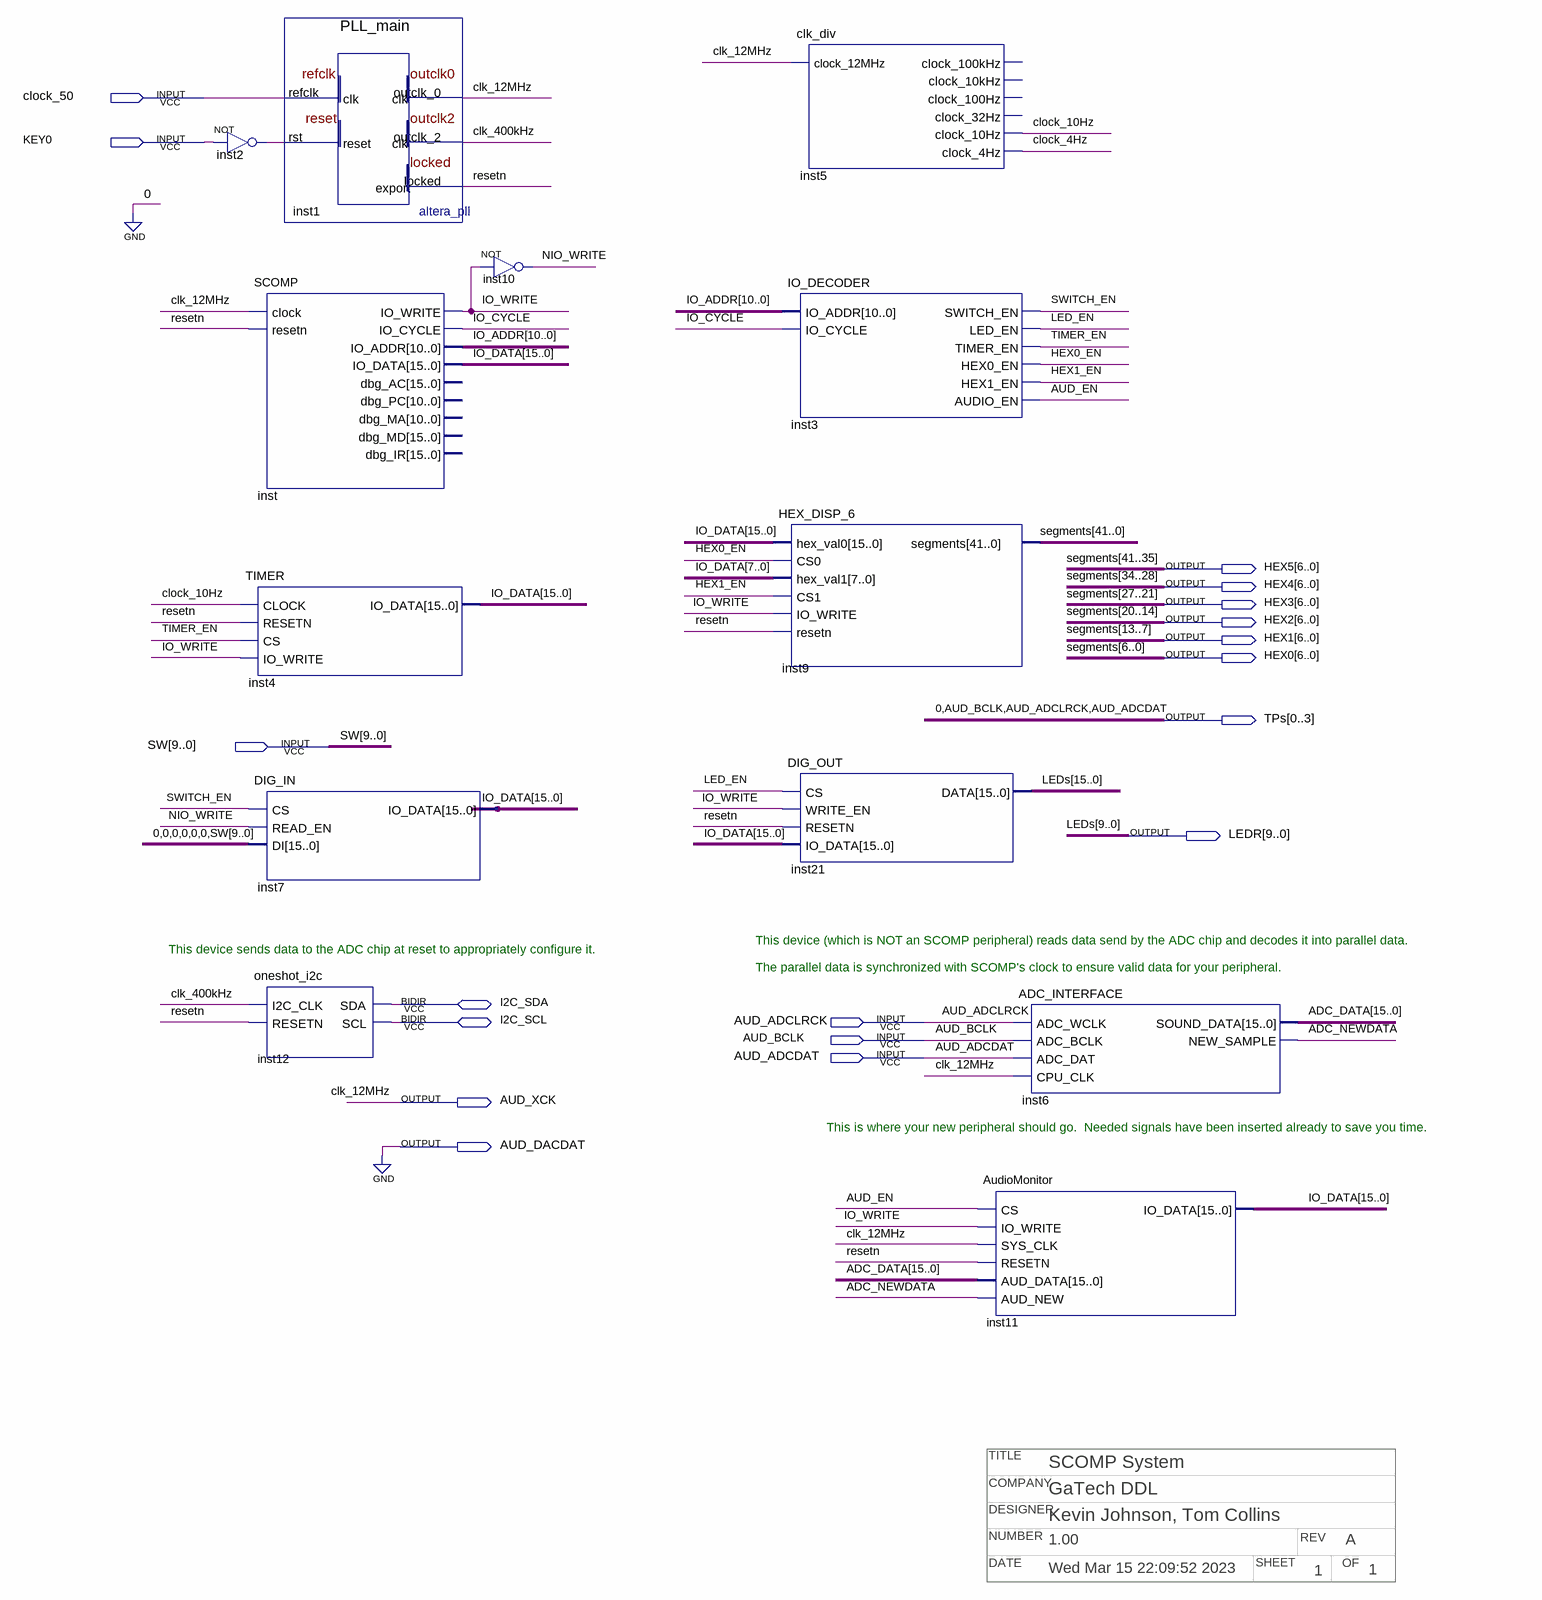
[diagram p0: schematic sheet]
// Quartus schematic SCOMP_System.bdf as structural Verilog: 13 symbols, 18 pins
// Title block: COMPANY: GaTech DDL; DATE: Wed Mar 15 22:09:52 2023; DESIGNER: Kevin Johnson, Tom Collins; NUMBER: 1.00; OF: 1; REV: A; SHEET: 1; TITLE: SCOMP System
module SCOMP_System (
  input  clock_50,
  input  KEY0,
  input  [9:0] SW,
  input  AUD_ADCLRCK,
  input  AUD_BCLK,
  input  AUD_ADCDAT,
  inout  I2C_SDA,
  inout  I2C_SCL,
  output [6:0] HEX5,
  output [6:0] HEX4,
  output [6:0] HEX3,
  output [6:0] HEX2,
  output [6:0] HEX1,
  output [6:0] HEX0,
  output [0:3] TPs,
  output [9:0] LEDR,
  output AUD_XCK,
  output AUD_DACDAT
);

  wire ADC_NEWDATA, AUD_EN, clk_400kHz, clock_4Hz, clock_10Hz, HEX0_EN, HEX1_EN, inst2_out, IO_CYCLE,
       IO_WRITE, LED_EN, NIO_WRITE, resetn, SWITCH_EN, TIMER_EN;
  wire [10:0] IO_ADDR;
  wire [15:0] ADC_DATA, IO_DATA;
  wire [15:10] LEDs;

  not inst2 (inst2_out, KEY0);
  SCOMP inst (
    .clock(AUD_XCK), .resetn(resetn), .IO_WRITE(IO_WRITE), .IO_CYCLE(IO_CYCLE), .IO_ADDR(IO_ADDR),
    .IO_DATA(IO_DATA));  // open: dbg_AC, dbg_PC, dbg_MA, dbg_MD, dbg_IR
  TIMER inst4 (.CLOCK(clock_10Hz), .RESETN(resetn), .CS(TIMER_EN), .IO_WRITE(IO_WRITE), .IO_DATA(IO_DATA));
  DIG_IN inst7 (.CS(SWITCH_EN), .READ_EN(NIO_WRITE), .DI({{6{1'b0}}, SW}), .IO_DATA(IO_DATA));
  oneshot_i2c inst12 (.I2C_CLK(clk_400kHz), .RESETN(resetn), .SDA(I2C_SDA), .SCL(I2C_SCL));
  PLL_main inst1 (.refclk(clock_50), .rst(inst2_out), .outclk_0(AUD_XCK), .outclk_2(clk_400kHz), .locked(resetn));
  not inst10 (NIO_WRITE, IO_WRITE);
  clk_div inst5 (
    .clock_12MHz(AUD_XCK), .clock_10Hz(clock_10Hz), .clock_4Hz(clock_4Hz));  // open: clock_100kHz, clock_10kHz, clock_100Hz, clock_32Hz
  IO_DECODER inst3 (
    .IO_ADDR(IO_ADDR), .IO_CYCLE(IO_CYCLE), .SWITCH_EN(SWITCH_EN), .LED_EN(LED_EN), .TIMER_EN(TIMER_EN),
    .HEX0_EN(HEX0_EN), .HEX1_EN(HEX1_EN), .AUDIO_EN(AUD_EN));
  HEX_DISP_6 inst9 (
    .hex_val0(IO_DATA), .CS0(HEX0_EN), .hex_val1(IO_DATA[7:0]), .CS1(HEX1_EN), .IO_WRITE(IO_WRITE),
    .resetn(resetn), .segments({HEX5, HEX4, HEX3, HEX2, HEX1, HEX0}));
  DIG_OUT inst21 (.CS(LED_EN), .WRITE_EN(IO_WRITE), .RESETN(resetn), .IO_DATA(IO_DATA), .DATA({LEDs, LEDR}));
  ADC_INTERFACE inst6 (
    .ADC_WCLK(AUD_ADCLRCK), .ADC_BCLK(AUD_BCLK), .ADC_DAT(AUD_ADCDAT), .CPU_CLK(AUD_XCK),
    .SOUND_DATA(ADC_DATA), .NEW_SAMPLE(ADC_NEWDATA));
  AudioMonitor inst11 (
    .CS(AUD_EN), .IO_WRITE(IO_WRITE), .SYS_CLK(AUD_XCK), .RESETN(resetn), .AUD_DATA(ADC_DATA),
    .AUD_NEW(ADC_NEWDATA), .IO_DATA(IO_DATA));

  assign AUD_DACDAT = 1'b0;
  assign TPs = {1'b0, AUD_BCLK, AUD_ADCLRCK, AUD_ADCDAT};

  // Other names for the same wires on the sheet: clk_12MHz = AUD_XCK; LEDs[9:0] = LEDR;
  //   segments[41:0] = {HEX5, HEX4, HEX3, HEX2, HEX1, HEX0}

  // Notes on the sheet:
  //   This device (which is NOT an SCOMP peripheral) reads data send by the ADC chip and decodes it into parallel data.
  //   This device sends data to the ADC chip at reset to appropriately configure it.
  //   The parallel data is synchronized with SCOMP's clock to ensure valid data for your peripheral.
  //   This is where your new peripheral should go.  Needed signals have been inserted already to save you time.
endmodule
